# EAGLE design Arduino-LED-Matrix-Shield_0.2 (EAGLE 5.11)
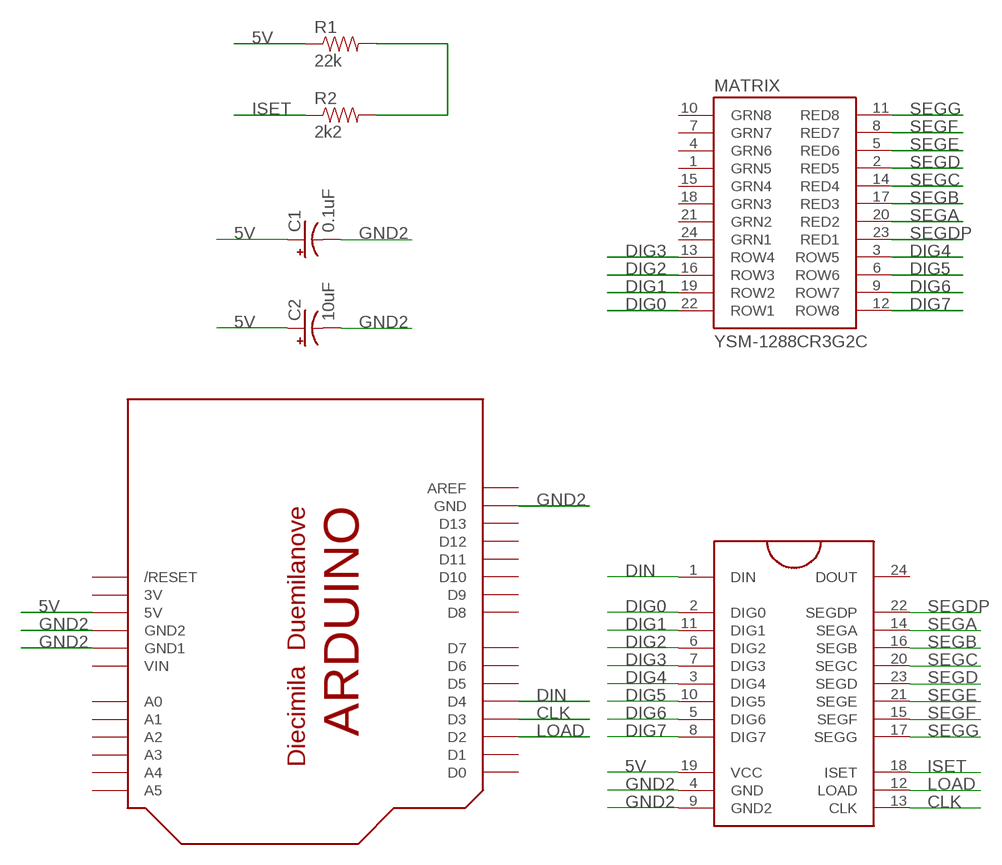
[diagram p0: schematic, sheet 1]

## Parts
C1  0.1uF  CAP_POLPTH2  [CPOL-RADIAL-10UF-25V]
C2  10uF  CAP_POLPTH2  [CPOL-RADIAL-10UF-25V]
CNTRL  MAX7219DIP  [DIL24]
MATRIX  YSM-1288CR3G2C  [YSM-1288CR3G2C]
R1  22k  RESISTORAXIAL-0.3  [AXIAL-0.3]
R2  2k2  RESISTORAXIAL-0.3  [AXIAL-0.3]
U$1  ARDUINO-NOHOLE  [ARDUINO-NOHOLE]

## Nets
5V: C1.1(+) C2.1(+) CNTRL.19(VCC) R1.P$1 U$1.5V
CLK: CNTRL.13(CLK) U$1.D3
DIG0: CNTRL.2(DIG0) MATRIX.22(ROW1)
DIG1: CNTRL.11(DIG1) MATRIX.19(ROW2)
DIG2: CNTRL.6(DIG2) MATRIX.16(ROW3)
DIG3: CNTRL.7(DIG3) MATRIX.13(ROW4)
DIG4: CNTRL.3(DIG4) MATRIX.3(ROW5)
DIG5: CNTRL.10(DIG5) MATRIX.6(ROW6)
DIG6: CNTRL.5(DIG6) MATRIX.9(ROW7)
DIG7: CNTRL.8(DIG7) MATRIX.12(ROW8)
DIN: CNTRL.1(DIN) U$1.D4
GND2: C1.2(-) C2.2(-) CNTRL.4(GND) CNTRL.9(GND2) U$1.GND U$1.GND1 U$1.GND2
ISET: CNTRL.18(ISET) R2.P$1
LOAD: CNTRL.12(LOAD) U$1.D2
N$2: R1.P$2 R2.P$2
SEGA: CNTRL.14(SEGA) MATRIX.20(RED2)
SEGB: CNTRL.16(SEGB) MATRIX.17(RED3)
SEGC: CNTRL.20(SEGC) MATRIX.14(RED4)
SEGD: CNTRL.23(SEGD) MATRIX.2(RED5)
SEGDP: CNTRL.22(SEGDP) MATRIX.23(RED1)
SEGE: CNTRL.21(SEGE) MATRIX.5(RED6)
SEGF: CNTRL.15(SEGF) MATRIX.8(RED7)
SEGG: CNTRL.17(SEGG) MATRIX.11(RED8)
Unconnected: CNTRL.24(DOUT) MATRIX.1(GRN5) MATRIX.4(GRN6) MATRIX.7(GRN7) MATRIX.10(GRN8) MATRIX.15(GRN4) MATRIX.18(GRN3) MATRIX.21(GRN2) MATRIX.24(GRN1) U$1.A0 U$1.A1 U$1.A2 U$1.A3 U$1.A4 U$1.A5 U$1.AREF U$1.D0 U$1.D1 U$1.D5 U$1.D6 U$1.D7 U$1.D8 U$1.D9 U$1.D10 U$1.D11 U$1.D12 U$1.D13 U$1.RESET(/RESET)

## Power pins joined to a net without a drawn wire
3V: U$1.3V
VIN: U$1.VIN

## Library data of the parts
C1 C2 = SparkFun:CAP_POL: Capacitor Polarized These are standard SMD and PTH capacitors. Normally 10uF, 47uF, and 100uF in electrolytic and tantalum varieties. Always verify the external diameter of the through hole cap, it varies with capacity, voltage, and manufacturer. The EIA devices should be standard.
CNTRL = SparkFun:MAX7219
MATRIX = led-matrix-v3:YSM-1288CR3G2C: LED Matrix - Dual Color (Red + Green) - Small sku: COM-00681 0.275 x 1.25 x 1.25"
R1 R2 = SparkFun:RESISTOR: Resistor Basic schematic elements and footprints for 0603, 1206, and PTH resistors.
U$1 = adafruit:ARDUINO: Arduino Diecimila/Duemilanove Make a shield with ease, this package has all the named pins as well as the two mounting drill holes and an outline of the USB and DC power connector. The outline is on the DIMENSION layer, so if your board house uses it they will cut the outline to match. http://www.ladyada.net/library/pcb/eaglelibrary.html

## Board
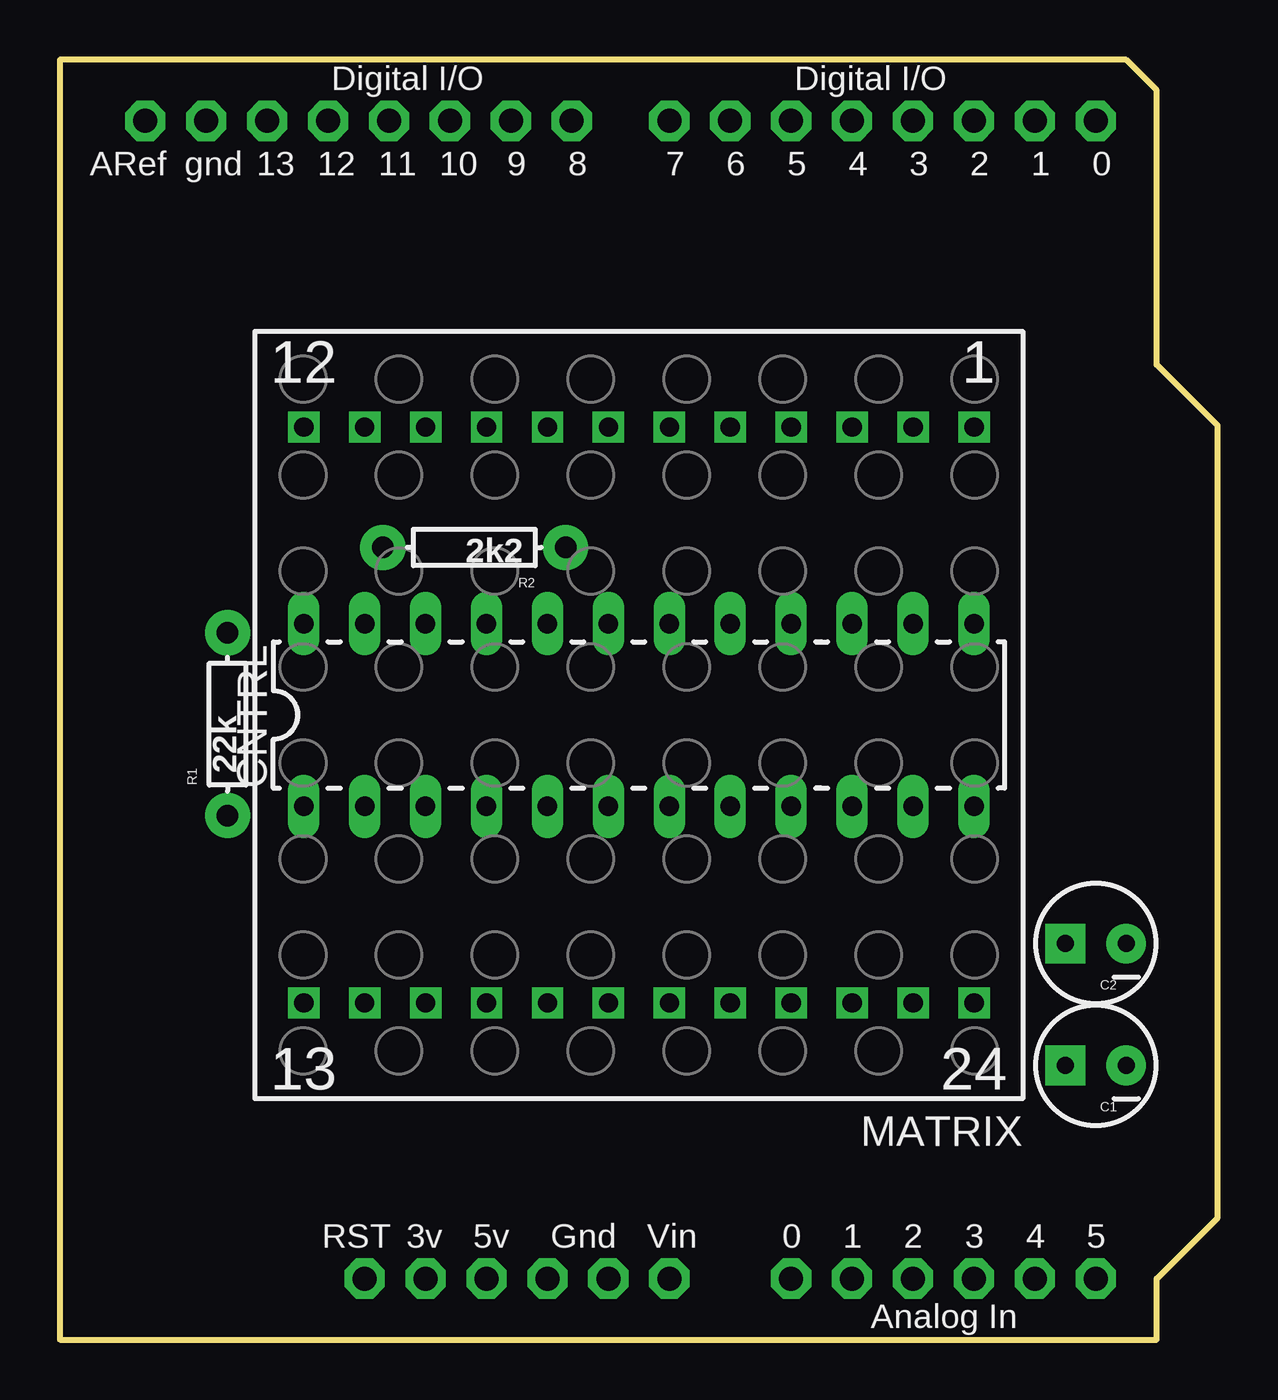
[diagram p1: board, top side]
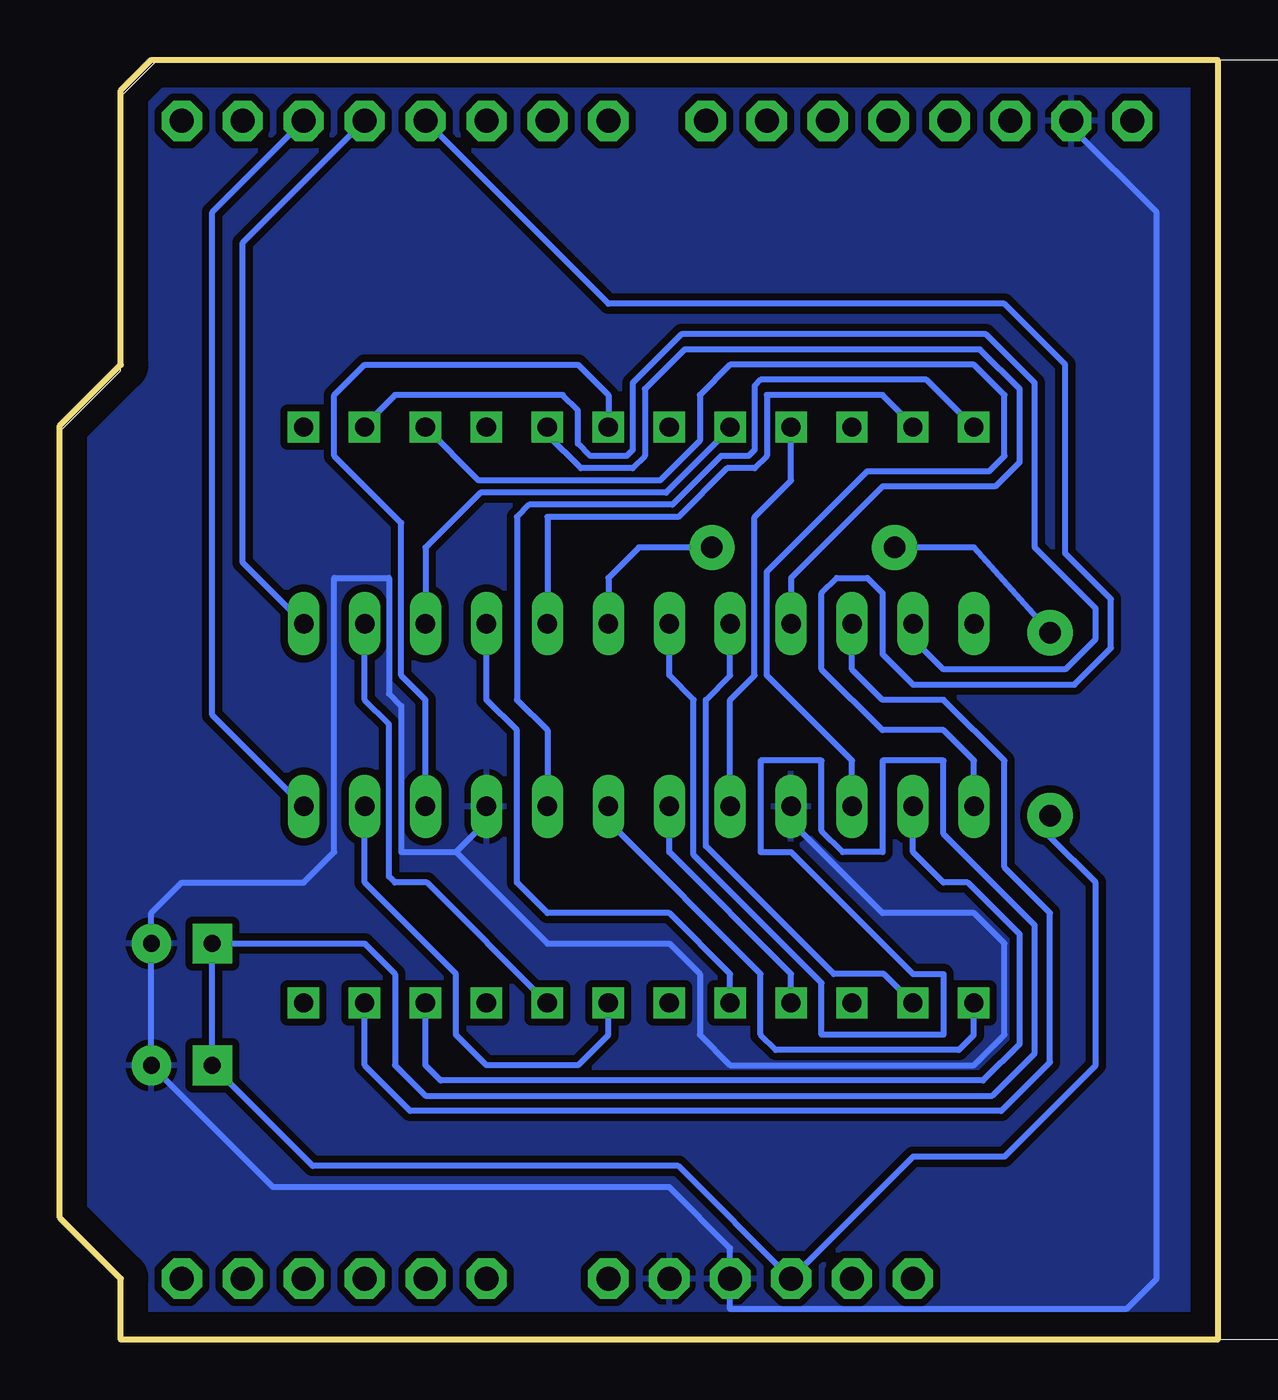
[diagram p2: board, bottom side, seen from below]

Size 48.26 x 53.34 mm. Coordinates in mm from the lower left corner, seen from the top.
Outline: 0,53.34 0,0 45.72,0 45.72,2.54 48.26,5.08 48.26,38.1 45.72,40.64 45.72,52.07 44.45,53.34 0,53.34
Copper layers (1*16): Top 0.035mm / dielectric 1.5mm / Bottom 0.035mm
Design rules "default": minimum track width 10mil, minimum drill 24mil, track to track 8mil, track to pad 8mil, pad to pad 8mil, via to via 8mil, smd to smd 8mil, copper to edge 40mil, drill to drill 8mil, minimum pad ring 10mil, minimum via ring 8mil, stop-mask expansion 4mil, vias tented up to drill 0mil, thermal gap 10mil

### Footprints (pad centres in the part's own frame; a part is rotated, then mirrored left to right if it is on the bottom)
CPOL-RADIAL-10UF-25V = drill 0.7 pad 1.651 square: 1 1.27,0 | drill 0.7 pad 1.651 round: 2 -1.27,0
DIL24 = drill 0.813 long: 1 -13.97,-3.81; 2 -11.43,-3.81; 3 -8.89,-3.81; 4 -6.35,-3.81; 5 -3.81,-3.81; 6 -1.27,-3.81; 7 1.27,-3.81; 8 3.81,-3.81; 9 6.35,-3.81; 10 8.89,-3.81; 11 11.43,-3.81; 12 13.97,-3.81; 13 13.97,3.81; 14 11.43,3.81; 15 8.89,3.81; 16 6.35,3.81; 17 3.81,3.81; 18 1.27,3.81; 19 -1.27,3.81; 20 -3.81,3.81; 21 -6.35,3.81; 22 -8.89,3.81; 23 -11.43,3.81; 24 -13.97,3.81
YSM-1288CR3G2C = drill 0.8 square: 1 -13.975,-12; 2 -11.435,-12; 3 -8.895,-12; 4 -6.355,-12; 5 -3.815,-12; 6 -1.275,-12; 7 1.265,-12; 8 3.805,-12; 9 6.345,-12; 10 8.885,-12; 11 11.425,-12; 12 13.965,-12; 13 13.965,12; 14 11.425,12; 15 8.885,12; 16 6.345,12; 17 3.805,12; 18 1.265,12; 19 -1.275,12; 20 -3.815,12; 21 -6.355,12; 22 -8.895,12; 23 -11.435,12; 24 -13.975,12
AXIAL-0.3 = drill 0.9 pad 1.88 round: P$1 -3.81,0; P$2 3.81,0
ARDUINO-NOHOLE = drill 1 pad 1.676 octagon: 3V 35.56,2.54; 5V 38.1,2.54; A0 50.8,2.54; A1 53.34,2.54; A2 55.88,2.54; A3 58.42,2.54; A4 60.96,2.54; A5 63.5,2.54; AREF 23.876,50.8; D0 63.5,50.8; D1 60.96,50.8; D2 58.42,50.8; D3 55.88,50.8; D4 53.34,50.8; D5 50.8,50.8; D6 48.26,50.8; D7 45.72,50.8; D8 41.656,50.8; D9 39.116,50.8; D10 36.576,50.8; D11 34.036,50.8; D12 31.496,50.8; D13 28.956,50.8; GND 26.416,50.8; GND1 43.18,2.54; GND2 40.64,2.54; RESET 33.02,2.54; VIN 45.72,2.54

### Placement (x,y rotation side)
C1  43.18,11.43 180 top
C2  43.18,16.51 180 top
CNTRL  24.13,26.04 0 top
MATRIX  24.13,26.04 180 top
R1  6.98,25.65 90 top
R2  17.27,33.02 180 top
U$1  -20.32,0 0 top

### Tracks (layer width: path | path; a pad name or v marks a point on that pad's centre or on a via)
5V
  Bottom 0.254: CNTRL.19 22.86,27.69 21.84,26.67 21.84,20.19 16.51,14.86 16.51,12.7 11.43,12.7 11.43,15.24 12.7,15.24 17.78,20.32 19.05,20.32 19.05,24.13 16.51,24.13 16.51,21.21 15.62,20.32 13.97,20.32 13.97,24.13 11.43,24.13 11.43,21.08 7.62,17.27 7.62,11.94 9.4,10.16 33.02,10.16 34.29,11.43 34.29,15.24 35.56,16.51 C2.1 C1.1 37.72,7.24 22.48,7.24 U$1.5V 12.7,7.62 8.89,7.62 5.08,11.43 5.08,19.05 6.98,20.95 R1.P$1
CLK
  Bottom 0.254: CNTRL.13 40.64,32.38 40.64,45.72 U$1.D3
DIG0
  Bottom 0.254: CNTRL.2 12.7,21.59 12.7,20.95 12.7,20.32 11.43,19.05 10.41,19.05 8.25,16.89 8.25,12.32 9.78,10.79 32.38,10.79 33.02,11.43 MATRIX.22
DIG1
  Bottom 0.254: CNTRL.11 35.56,19.05 31.75,15.24 31.75,12.7 30.48,11.43 26.67,11.43 25.4,12.7 MATRIX.19
DIG2
  Bottom 0.254: MATRIX.16 17.78,15.23 17.78,15.24 22.86,20.32 CNTRL.6
DIG3
  Bottom 0.254: MATRIX.13 10.16,12.7 10.79,12.06 18.41,12.06 19.05,12.7 19.05,15.24 25.4,21.59 CNTRL.7
DIG4
  Bottom 0.254: 32.95,38.03 MATRIX.3 30.8,35.81 23.24,35.81 21.59,37.47 21.59,39.37 20.32,40.64 10.16,40.64 8.89,39.37 8.89,36.83 9.52,36.2 14.6,36.2 18.8,32 18.8,27.69 15.24,24.13 CNTRL.3
DIG5
  Bottom 0.254: CNTRL.10 33.02,26.67 34.04,27.69 34.04,34.04 36.83,36.83 36.83,39.37 35.56,40.64 26.67,40.64 25.4,39.37 MATRIX.6
DIG6
  Bottom 0.254: CNTRL.5 20.32,26.67 19.3,27.69 19.3,34.29 17.78,35.81 MATRIX.9
DIG7
  Bottom 0.254: 10.16,38.1 MATRIX.12 12.13,40.01 19.05,40.01 19.3,39.75 19.3,37.08 19.56,36.83 20.7,36.83 22.73,34.8 28.7,34.8 29.21,34.29 29.21,26.67 27.94,25.4 CNTRL.8
DIN
  Bottom 0.254: CNTRL.1 10.16,24.13 11.43,25.4 13.97,25.4 16.51,27.94 16.51,31.11 15.88,31.75 14.6,31.75 13.97,31.11 13.97,28.57 12.7,27.3 5.97,27.3 4.45,28.83 4.45,30.86 6.35,32.77 6.35,40.64 8.89,43.18 25.4,43.18 U$1.D4
GND2
  Bottom 0.254: CNTRL.4 17.78,21.59 13.97,17.78 10.16,17.78 8.89,16.51 8.89,12.7 10.16,11.43 20.32,11.43 21.59,12.7 21.59,15.24 22.86,16.51 27.94,16.51 31.75,20.32 | CNTRL.9 30.48,21.59 31.75,20.32 | 31.75,20.32 34.04,20.32 34.04,26.42 34.54,26.92 34.54,31.75 36.83,31.75 36.83,20.32 38.1,19.05 43.18,19.05 44.45,17.78 C2.2 C1.2 39.37,6.35 22.86,6.35 20.32,3.81 U$1.GND2 20.32,1.27 3.81,1.27 2.54,2.54 2.54,46.99 6.1,50.55 U$1.GND
  pour Bottom (isolate 0.305): 0,53.34 0,0 45.72,0 45.72,2.54 48.26,5.08 48.26,38.1 45.72,40.64 45.72,52.07 44.45,53.34
ISET
  Bottom 0.254: R2.P$1 24.13,33.02 25.4,31.75 CNTRL.18
LOAD
  Bottom 0.254: CNTRL.12 41.91,26.04 41.91,46.99 U$1.D2
N$2
  Bottom 0.254: R2.P$2 10.16,33.02 R1.P$2
SEGA
  Bottom 0.254: CNTRL.14 35.56,26.67 34.54,25.65 34.54,19.3 34.29,19.05 32.96,19.05 MATRIX.20
SEGB
  Bottom 0.254: MATRIX.17 20.33,15.23 20.32,15.24 22.86,17.78 27.94,17.78 29.21,19.05 29.21,25.4 30.48,26.67 CNTRL.16
SEGC
  Bottom 0.254: CNTRL.20 20.32,27.69 21.34,26.67 21.34,20.57 16,15.24 13.91,15.24 MATRIX.14
SEGD
  Bottom 0.254: MATRIX.2 35.56,38.09 34.29,39.37 27.3,39.37 26.67,38.73 26.67,37.34 26.16,36.83 24.64,36.83 24.38,37.08 24.38,39.88 22.35,41.91 9.65,41.91 7.62,39.88 7.62,33.02 5.08,30.48 5.08,29.21 6.35,27.94 11.43,27.94 12.7,29.21 CNTRL.23
SEGDP
  Bottom 0.254: CNTRL.22 15.24,27.94 13.97,26.67 11.43,26.67 8.89,24.13 8.89,19.68 6.98,17.78 6.98,11.56 9.02,9.53 33.66,9.53 35.56,11.43 MATRIX.23
SEGE
  Bottom 0.254: MATRIX.5 27.95,37.72 26.54,36.32 24.38,36.32 23.88,36.83 23.88,39.62 22.23,41.27 9.91,41.27 8.25,39.62 8.25,36.58 9.27,35.56 13.97,35.56 17.78,31.75 CNTRL.21
SEGF
  Bottom 0.254: CNTRL.15 33.02,33.02 30.73,35.31 22.99,35.31 20.33,37.97 MATRIX.8
SEGG
  Bottom 0.254: MATRIX.11 12.7,38.1 13.97,39.37 18.8,39.37 18.8,36.83 19.3,36.32 20.45,36.32 22.48,34.29 27.94,34.29 CNTRL.17

### Text on the board
tNames: 12 | 1 | 13 | 24